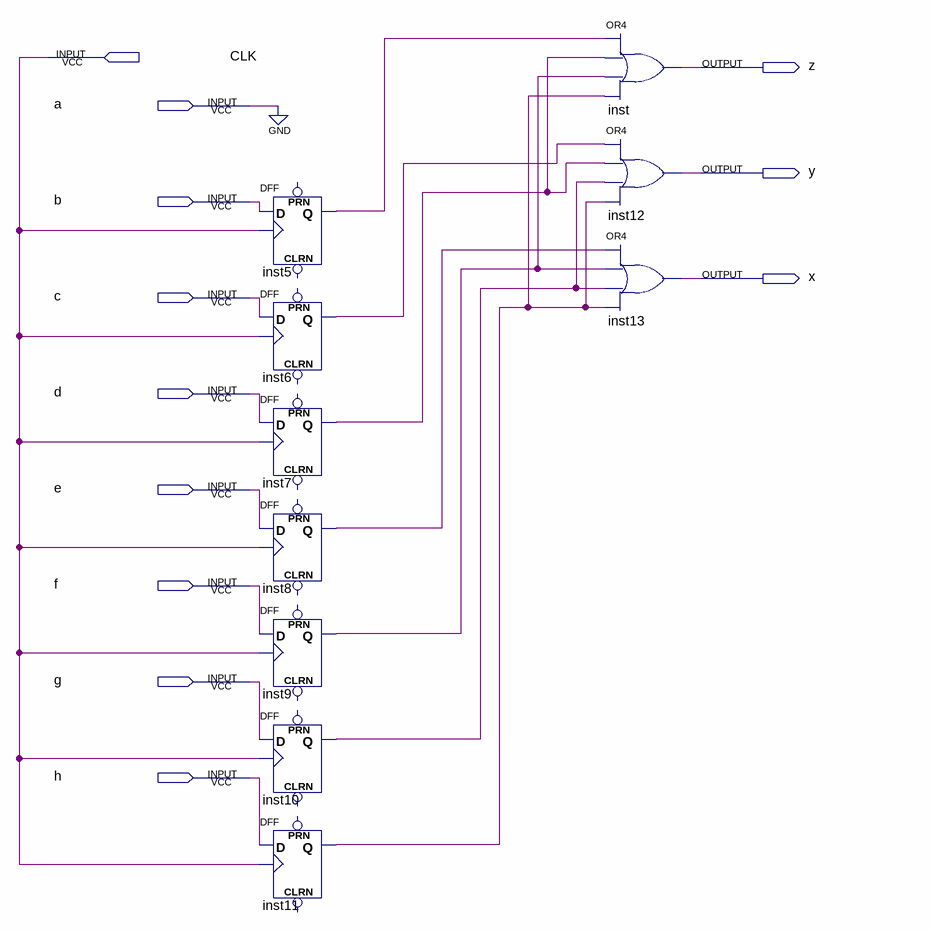
[diagram p0: schematic sheet]
// Quartus schematic lab1.bdf as structural Verilog: 10 symbols, 12 pins
module lab1 (
  input  CLK,
  input  a,
  input  b,
  input  c,
  input  d,
  input  e,
  input  f,
  input  g,
  input  h,
  output z,
  output y,
  output x
);

  wire inst5_q, inst6_q, inst7_q, inst8_q, inst9_q, inst10_q, inst11_q;

  DFF inst5 (.CLK(CLK), .D(b), .Q(inst5_q));  // open: CLRN, PRN
  DFF inst6 (.CLK(CLK), .D(c), .Q(inst6_q));  // open: CLRN, PRN
  DFF inst7 (.CLK(CLK), .D(d), .Q(inst7_q));  // open: CLRN, PRN
  DFF inst8 (.CLK(CLK), .D(e), .Q(inst8_q));  // open: CLRN, PRN
  DFF inst9 (.CLK(CLK), .D(f), .Q(inst9_q));  // open: CLRN, PRN
  DFF inst10 (.CLK(CLK), .D(g), .Q(inst10_q));  // open: CLRN, PRN
  DFF inst11 (.CLK(CLK), .D(h), .Q(inst11_q));  // open: CLRN, PRN
  or inst (z, inst5_q, inst7_q, inst9_q, inst11_q);
  or inst12 (y, inst6_q, inst7_q, inst10_q, inst11_q);
  or inst13 (x, inst8_q, inst9_q, inst10_q, inst11_q);
  // also tied to GND on the sheet: a
endmodule
